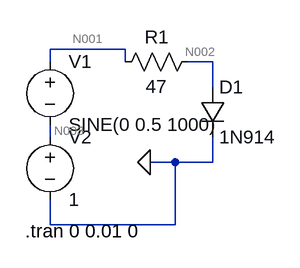
[diagram p0: schematic Draft2.asc]
Draft2.asc, the LTspice schematic file:
Version 4
SHEET 1 880 680
WIRE 176 48 80 48
WIRE 80 64 80 48
WIRE 176 64 176 48
WIRE 288 64 256 64
WIRE 288 96 288 64
WIRE 80 160 80 144
WIRE 240 192 208 192
WIRE 288 192 288 160
WIRE 288 192 240 192
WIRE 80 272 80 240
WIRE 240 272 240 192
WIRE 240 272 80 272
FLAG 208 192 0
SYMBOL res 160 80 R270
WINDOW 0 32 56 VTop 2
WINDOW 3 0 56 VBottom 2
SYMATTR InstName R1
SYMATTR Value 47
SYMBOL diode 272 96 R0
SYMATTR InstName D1
SYMATTR Value 1N914
SYMBOL voltage 80 48 R0
WINDOW 123 0 0 Left 0
WINDOW 39 0 0 Left 0
SYMATTR InstName V1
SYMATTR Value SINE(0 0.5 1000)
SYMBOL voltage 80 144 R0
WINDOW 123 0 0 Left 0
WINDOW 39 0 0 Left 0
SYMATTR InstName V2
SYMATTR Value 1
TEXT 48 280 Left 2 !.tran 0 0.01 0

The netlist it stands for:
* Draft2.asc
R1 N001 N002 47
D1 N002 0 1N914
V1 N001 N003 SINE(0 0.5 1000)
V2 N003 0 1
.model D D
.lib standard.dio
.tran 0 0.01 0
.backanno
.end

* Results of the author's LTspice run, read from the files saved beside the schematic
* Operating Point, zero values left out:
*   V(n001) = 1 V
*   V(n002) = 675.6 mV
*   V(n003) = 1 V
*   I(D1) = 6.901 mA
*   I(R1) = 6.901 mA
*   I(V2) = -6.901 mA
*   I(V1) = -6.901 mA
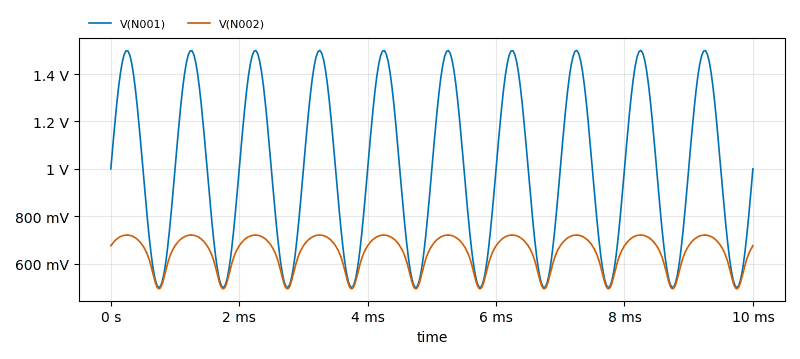
[diagram p1: Transient Analysis of Draft2.asc, plotted from the saved traces]
* Transient Analysis, 1 run:
*   V(N001): min 500 mV, max 1.5 V, average 999.5 mV, rms 1.06 V, last 1 V
*   V(N002): min 494.1 mV, max 720.8 mV, average 646 mV, rms 650.3 mV, last 675.6 mV